# Altium schematic sheet FPGA.schdoc: =ProjectName
size A2; Author: P.K.; CompanyName: WUT; DrawnBy: P.K.; Organization: WUT ISE; Address1: Warsaw Univeristy of Technology; Address2: Nowowiejska 15/19; DocumentNumber: 2; Revision: 1.1; SheetNumber: 2; SheetTotal: 12; EDA_Number: ARTIQ; Projet: ARTIQ/SINARA; ModifiedBy: -; CreateDate: XX/XX/XXXX; CheckedDate: -; Title2: FPGA.schdoc; DivGrp: ISE; Designer: P.K.; ModifiedDate: -; ProjectName: ARTIQ/SINARA
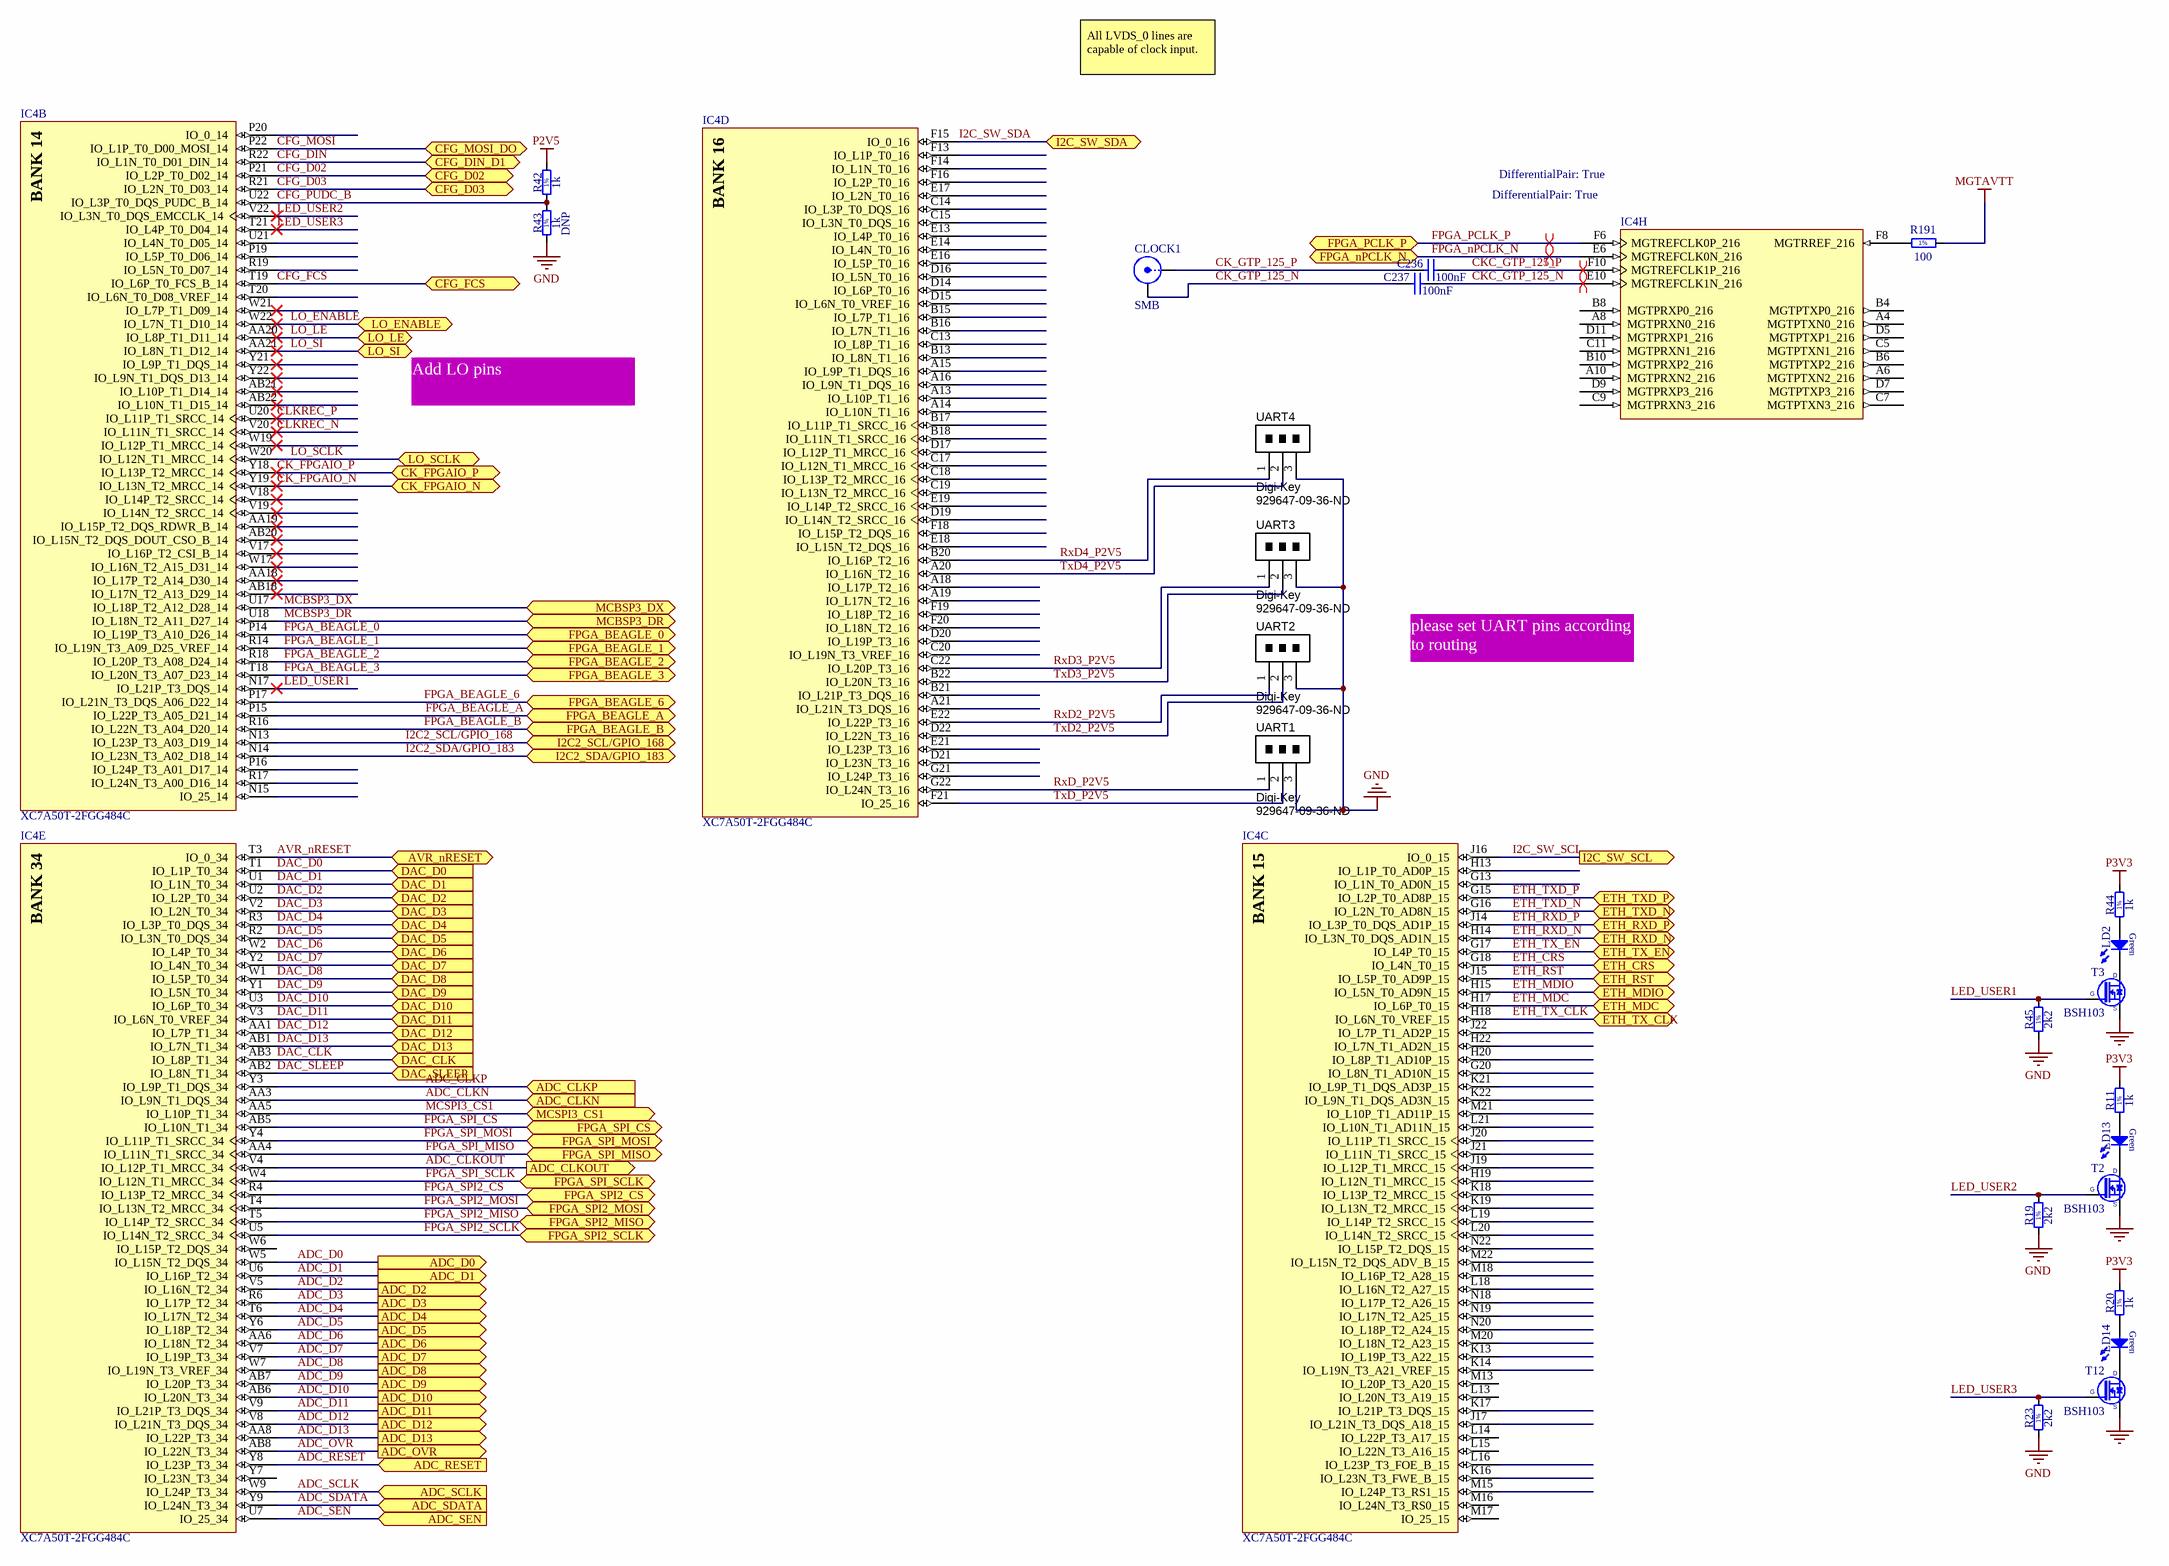
[diagram p0: FPGA.schdoc]

## Parts
(Parts that share a designator on the sheet are numbered #1, #2 ... from top to bottom, then left to right.)
C236  100nF  [0603 Polar Cap]
C237  100nF  [0603 Polar Cap]
CLOCK1  SMB  [SMB_V-RJ45]
IC4#1  XC7A50T-2FGG484C  [FGG484]  (part B of 10)
IC4#2  XC7A50T-2FGG484C  [FGG484]  (parts C,D,E,H of 10)
LD2  (no value)  [LED-0603-GREEN]
LD13  (no value)  [LED-0603-GREEN]
LD14  (no value)  [LED-0603-GREEN]
R11  1k  [RESC1005X40N]
R19  2k2  [RESC1005X40N]
R20  1k  [RESC1005X40N]
R23  2k2  [RESC1005X40N]
R42  1k  [RESC1005X40N]
R43  1k  [RESC1005X40N]
R44  1k  [RESC1005X40N]
R45  2k2  [RESC1005X40N]
R191  100  [RESC1005X40N]
T2  BSH103  [SOT95P230X110-3N]
T3  BSH103  [SOT95P230X110-3N]
T12  BSH103  [SOT95P230X110-3N]
UART1  Supplier 1: Digi-Key  Supplier Part Number 1: 929647-09-36-ND  [1x3POS_HEADER]  (hidden comment: R T G)
UART2  Supplier 1: Digi-Key  Supplier Part Number 1: 929647-09-36-ND  [1x3POS_HEADER]  (hidden comment: R T G)
UART3  Supplier 1: Digi-Key  Supplier Part Number 1: 929647-09-36-ND  [1x3POS_HEADER]  (hidden comment: R T G)
UART4  Supplier 1: Digi-Key  Supplier Part Number 1: 929647-09-36-ND  [1x3POS_HEADER]  (hidden comment: R T G)

## Ports
ADC_CLKN (in), ADC_CLKOUT (out), ADC_CLKP (in), ADC_D0 (out), ADC_D1 (out), ADC_D2 (out), ADC_D3 (out), ADC_D4 (out), ADC_D5 (out), ADC_D6 (out), ADC_D7 (out), ADC_D8 (out), ADC_D9 (out), ADC_D10 (out), ADC_D11 (out), ADC_D12 (out), ADC_D13 (out), ADC_OVR (out), ADC_RESET (in), ADC_SCLK (in), ADC_SDATA (in), ADC_SEN (in), AVR_nRESET (bidir), CFG_D02 (bidir), CFG_D03 (bidir), CFG_DIN_D1 (bidir), CFG_FCS (bidir), CFG_MOSI_DO (bidir), CK_FPGAIO_N (bidir), CK_FPGAIO_P (bidir), DAC_CLK (in), DAC_D0 (in), DAC_D1 (in), DAC_D2 (in), DAC_D3 (in), DAC_D4 (in), DAC_D5 (in), DAC_D6 (in), DAC_D7 (in), DAC_D8 (in), DAC_D9 (in), DAC_D10 (in), DAC_D11 (in), DAC_D12 (in), DAC_D13 (in), DAC_SLEEP (in), ETH_CRS, ETH_MDC, ETH_MDIO, ETH_RST, ETH_RXD_N, ETH_RXD_P, ETH_TX_CLK, ETH_TX_EN, ETH_TXD_N, ETH_TXD_P, FPGA_BEAGLE_0 (bidir), FPGA_BEAGLE_1 (bidir), FPGA_BEAGLE_2 (bidir), FPGA_BEAGLE_3 (bidir), FPGA_BEAGLE_6 (bidir), FPGA_BEAGLE_A (bidir), FPGA_BEAGLE_B (bidir), FPGA_nPCLK_N (bidir), FPGA_PCLK_P (bidir), FPGA_SPI2_CS (bidir), FPGA_SPI2_MISO (bidir), FPGA_SPI2_MOSI (bidir), FPGA_SPI2_SCLK (bidir), FPGA_SPI_CS (bidir), FPGA_SPI_MISO (bidir), FPGA_SPI_MOSI (bidir), FPGA_SPI_SCLK (bidir), I2C2_SCL/GPIO_168 (bidir), I2C2_SDA/GPIO_183 (bidir), I2C_SW_SCL (out), I2C_SW_SDA (bidir), LO_ENABLE, LO_LE, LO_SCLK, LO_SI, MCBSP3_DR (bidir), MCBSP3_DX (bidir), MCSPI3_CS1 (bidir)

## Nets
GND: R19.1 R23.1 R43.1 R45.1 T2.2(S) T3.2(S) T12.2(S) UART1.3 UART2.3 UART3.3 UART4.3
MGTAVTT: R191.1
P2V5: R42.2
P3V3: R11.2 R20.2 R44.2
ADC_CLKN: IC4#2.AA3(IO_L9N_T1_DQS_34) ; port ADC_CLKN
ADC_CLKOUT: IC4#2.V4(IO_L12P_T1_MRCC_34) ; port ADC_CLKOUT
ADC_CLKP: IC4#2.Y3(IO_L9P_T1_DQS_34) ; port ADC_CLKP
ADC_D0: IC4#2.W5(IO_L15N_T2_DQS_34) ; port ADC_D0
ADC_D1: IC4#2.U6(IO_L16P_T2_34) ; port ADC_D1
ADC_D2: IC4#2.V5(IO_L16N_T2_34) ; port ADC_D2
ADC_D3: IC4#2.R6(IO_L17P_T2_34) ; port ADC_D3
ADC_D4: IC4#2.T6(IO_L17N_T2_34) ; port ADC_D4
ADC_D5: IC4#2.Y6(IO_L18P_T2_34) ; port ADC_D5
ADC_D6: IC4#2.AA6(IO_L18N_T2_34) ; port ADC_D6
ADC_D7: IC4#2.V7(IO_L19P_T3_34) ; port ADC_D7
ADC_D8: IC4#2.W7(IO_L19N_T3_VREF_34) ; port ADC_D8
ADC_D9: IC4#2.AB7(IO_L20P_T3_34) ; port ADC_D9
ADC_D10: IC4#2.AB6(IO_L20N_T3_34) ; port ADC_D10
ADC_D11: IC4#2.V9(IO_L21P_T3_DQS_34) ; port ADC_D11
ADC_D12: IC4#2.V8(IO_L21N_T3_DQS_34) ; port ADC_D12
ADC_D13: IC4#2.AA8(IO_L22P_T3_34) ; port ADC_D13
ADC_OVR: IC4#2.AB8(IO_L22N_T3_34) ; port ADC_OVR
ADC_RESET: IC4#2.Y8(IO_L23P_T3_34) ; port ADC_RESET
ADC_SCLK: IC4#2.W9(IO_L24P_T3_34) ; port ADC_SCLK
ADC_SDATA: IC4#2.Y9(IO_L24N_T3_34) ; port ADC_SDATA
ADC_SEN: IC4#2.U7(IO_25_34) ; port ADC_SEN
AVR_nRESET: IC4#2.T3(IO_0_34) ; port AVR_nRESET
CFG_D02: IC4#1.P21(IO_L2P_T0_D02_14) ; port CFG_D02
CFG_D03: IC4#1.R21(IO_L2N_T0_D03_14) ; port CFG_D03
CFG_DIN: IC4#1.R22(IO_L1N_T0_D01_DIN_14) ; port CFG_DIN_D1
CFG_FCS: IC4#1.T19(IO_L6P_T0_FCS_B_14) ; port CFG_FCS
CFG_MOSI: IC4#1.P22(IO_L1P_T0_D00_MOSI_14) ; port CFG_MOSI_DO
CFG_PUDC_B: IC4#1.U22(IO_L3P_T0_DQS_PUDC_B_14) R42.1 R43.2
CK_FPGAIO_N: IC4#1.Y19(IO_L13N_T2_MRCC_14) ; port CK_FPGAIO_N
CK_FPGAIO_P: IC4#1.Y18(IO_L13P_T2_MRCC_14) ; port CK_FPGAIO_P
CK_GTP_125_N: C237.1 CLOCK1.2(Y)
CK_GTP_125_P: C236.1 CLOCK1.1(X)
CKC_GTP_125_N: C237.2 IC4#2.E10(MGTREFCLK1N_216)
CKC_GTP_125_P: C236.2 IC4#2.F10(MGTREFCLK1P_216)
CLKREC_N: IC4#1.V20(IO_L11N_T1_SRCC_14)
CLKREC_P: IC4#1.U20(IO_L11P_T1_SRCC_14)
DAC_CLK: IC4#2.AB3(IO_L8P_T1_34) ; port DAC_CLK
DAC_D0: IC4#2.T1(IO_L1P_T0_34) ; port DAC_D0
DAC_D1: IC4#2.U1(IO_L1N_T0_34) ; port DAC_D1
DAC_D2: IC4#2.U2(IO_L2P_T0_34) ; port DAC_D2
DAC_D3: IC4#2.V2(IO_L2N_T0_34) ; port DAC_D3
DAC_D4: IC4#2.R3(IO_L3P_T0_DQS_34) ; port DAC_D4
DAC_D5: IC4#2.R2(IO_L3N_T0_DQS_34) ; port DAC_D5
DAC_D6: IC4#2.W2(IO_L4P_T0_34) ; port DAC_D6
DAC_D7: IC4#2.Y2(IO_L4N_T0_34) ; port DAC_D7
DAC_D8: IC4#2.W1(IO_L5P_T0_34) ; port DAC_D8
DAC_D9: IC4#2.Y1(IO_L5N_T0_34) ; port DAC_D9
DAC_D10: IC4#2.U3(IO_L6P_T0_34) ; port DAC_D10
DAC_D11: IC4#2.V3(IO_L6N_T0_VREF_34) ; port DAC_D11
DAC_D12: IC4#2.AA1(IO_L7P_T1_34) ; port DAC_D12
DAC_D13: IC4#2.AB1(IO_L7N_T1_34) ; port DAC_D13
DAC_SLEEP: IC4#2.AB2(IO_L8N_T1_34) ; port DAC_SLEEP
ETH_CRS: IC4#2.G18(IO_L4N_T0_15) ; port ETH_CRS
ETH_MDC: IC4#2.H17(IO_L6P_T0_15) ; port ETH_MDC
ETH_MDIO: IC4#2.H15(IO_L5N_T0_AD9N_15) ; port ETH_MDIO
ETH_RST: IC4#2.J15(IO_L5P_T0_AD9P_15) ; port ETH_RST
ETH_RXD_N: IC4#2.H14(IO_L3N_T0_DQS_AD1N_15) ; port ETH_RXD_N
ETH_RXD_P: IC4#2.J14(IO_L3P_T0_DQS_AD1P_15) ; port ETH_RXD_P
ETH_TX_CLK: IC4#2.H18(IO_L6N_T0_VREF_15) ; port ETH_TX_CLK
ETH_TX_EN: IC4#2.G17(IO_L4P_T0_15) ; port ETH_TX_EN
ETH_TXD_N: IC4#2.G16(IO_L2N_T0_AD8N_15) ; port ETH_TXD_N
ETH_TXD_P: IC4#2.G15(IO_L2P_T0_AD8P_15) ; port ETH_TXD_P
FPGA_BEAGLE_0: IC4#1.P14(IO_L19P_T3_A10_D26_14) ; port FPGA_BEAGLE_0
FPGA_BEAGLE_1: IC4#1.R14(IO_L19N_T3_A09_D25_VREF_14) ; port FPGA_BEAGLE_1
FPGA_BEAGLE_2: IC4#1.R18(IO_L20P_T3_A08_D24_14) ; port FPGA_BEAGLE_2
FPGA_BEAGLE_3: IC4#1.T18(IO_L20N_T3_A07_D23_14) ; port FPGA_BEAGLE_3
FPGA_BEAGLE_6: IC4#1.P17(IO_L21N_T3_DQS_A06_D22_14) ; port FPGA_BEAGLE_6
FPGA_BEAGLE_A: IC4#1.P15(IO_L22P_T3_A05_D21_14) ; port FPGA_BEAGLE_A
FPGA_BEAGLE_B: IC4#1.R16(IO_L22N_T3_A04_D20_14) ; port FPGA_BEAGLE_B
FPGA_nPCLK_N: IC4#2.E6(MGTREFCLK0N_216) ; port FPGA_nPCLK_N
FPGA_PCLK_P: IC4#2.F6(MGTREFCLK0P_216) ; port FPGA_PCLK_P
FPGA_SPI2_CS: IC4#2.R4(IO_L13P_T2_MRCC_34) ; port FPGA_SPI2_CS
FPGA_SPI2_MISO: IC4#2.T5(IO_L14P_T2_SRCC_34) ; port FPGA_SPI2_MISO
FPGA_SPI2_MOSI: IC4#2.T4(IO_L13N_T2_MRCC_34) ; port FPGA_SPI2_MOSI
FPGA_SPI2_SCLK: IC4#2.U5(IO_L14N_T2_SRCC_34) ; port FPGA_SPI2_SCLK
FPGA_SPI_CS: IC4#2.AB5(IO_L10N_T1_34) ; port FPGA_SPI_CS
FPGA_SPI_MISO: IC4#2.AA4(IO_L11N_T1_SRCC_34) ; port FPGA_SPI_MISO
FPGA_SPI_MOSI: IC4#2.Y4(IO_L11P_T1_SRCC_34) ; port FPGA_SPI_MOSI
FPGA_SPI_SCLK: IC4#2.W4(IO_L12N_T1_MRCC_34) ; port FPGA_SPI_SCLK
I2C2_SCL/GPIO_168: IC4#1.N13(IO_L23P_T3_A03_D19_14) ; port I2C2_SCL/GPIO_168
I2C2_SDA/GPIO_183: IC4#1.N14(IO_L23N_T3_A02_D18_14) ; port I2C2_SDA/GPIO_183
I2C_SW_SCL: IC4#2.J16(IO_0_15) ; port I2C_SW_SCL
I2C_SW_SDA: IC4#2.F15(IO_0_16) ; port I2C_SW_SDA
LED_USER1: IC4#1.N17(IO_L21P_T3_DQS_14) R45.2 T3.1(G)
LED_USER2: IC4#1.V22(IO_L3N_T0_DQS_EMCCLK_14) R19.2 T2.1(G)
LED_USER3: IC4#1.T21(IO_L4P_T0_D04_14) R23.2 T12.1(G)
LO_ENABLE: IC4#1.W22(IO_L7N_T1_D10_14) ; port LO_ENABLE
LO_LE: IC4#1.AA20(IO_L8P_T1_D11_14) ; port LO_LE
LO_SCLK: IC4#1.W20(IO_L12N_T1_MRCC_14) ; port LO_SCLK
LO_SI: IC4#1.AA21(IO_L8N_T1_D12_14) ; port LO_SI
MCBSP3_DR: IC4#1.U18(IO_L18N_T2_A11_D27_14)
MCBSP3_DX: IC4#1.U17(IO_L18P_T2_A12_D28_14) ; port MCBSP3_DX
MCSPI3_CS1: IC4#2.AA5(IO_L10P_T1_34) ; port MCSPI3_CS1
RxD2_P2V5: IC4#2.E22(IO_L22P_T3_16) UART2.1
RxD3_P2V5: IC4#2.C22(IO_L20P_T3_16) UART3.1
RxD4_P2V5: IC4#2.B20(IO_L16P_T2_16) UART4.1
RxD_P2V5: IC4#2.G22(IO_L24N_T3_16) UART1.1
TxD2_P2V5: IC4#2.D22(IO_L22N_T3_16) UART2.2
TxD3_P2V5: IC4#2.B22(IO_L20N_T3_16) UART3.2
TxD4_P2V5: IC4#2.A20(IO_L16N_T2_16) UART4.2
TxD_P2V5: IC4#2.F21(IO_25_16) UART1.2
NetIC4#2_F8: IC4#2.F8(MGTRREF_216) R191.2
NetLD2_1: LD2.1(A) R44.1
NetLD2_2: LD2.2(C) T3.3(D)
NetLD13_1: LD13.1(A) R11.1
NetLD13_2: LD13.2(C) T2.3(D)
NetLD14_1: LD14.1(A) R20.1
NetLD14_2: LD14.2(C) T12.3(D)

Not connected (* = marked no-connect by the designer): IC4#1 AA18(IO_L17P_T2_A14_D30_14)* AA19(IO_L15P_T2_DQS_RDWR_B_14)* AB18(IO_L17N_T2_A13_D29_14)* AB20(IO_L15N_T2_DQS_DOUT_CSO_B_14)* AB21(IO_L10P_T1_D14_14)* AB22(IO_L10N_T1_D15_14)* N15(IO_25_14) P16(IO_L24P_T3_A01_D17_14) P19(IO_L5P_T0_D06_14) P20(IO_0_14) R17(IO_L24N_T3_A00_D16_14) R19(IO_L5N_T0_D07_14) T20(IO_L6N_T0_D08_VREF_14) U21(IO_L4N_T0_D05_14) V17(IO_L16P_T2_CSI_B_14)* V18(IO_L14P_T2_SRCC_14)* V19(IO_L14N_T2_SRCC_14)* W17(IO_L16N_T2_A15_D31_14)* W19(IO_L12P_T1_MRCC_14)* W21(IO_L7P_T1_D09_14)* Y21(IO_L9P_T1_DQS_14)* Y22(IO_L9N_T1_DQS_D13_14)*; IC4#2 A4(MGTPTXN0_216) A6(MGTPTXN2_216) A8(MGTPRXN0_216) A10(MGTPRXN2_216) A13(IO_L10P_T1_16) A14(IO_L10N_T1_16) A15(IO_L9P_T1_DQS_16) A16(IO_L9N_T1_DQS_16) A18(IO_L17P_T2_16) A19(IO_L17N_T2_16) A21(IO_L21N_T3_DQS_16) B4(MGTPTXP0_216) B6(MGTPTXP2_216) B8(MGTPRXP0_216) B10(MGTPRXP2_216) B13(IO_L8N_T1_16) B15(IO_L7P_T1_16) B16(IO_L7N_T1_16) B17(IO_L11P_T1_SRCC_16) B18(IO_L11N_T1_SRCC_16) B21(IO_L21P_T3_DQS_16) C5(MGTPTXN1_216) C7(MGTPTXN3_216) C9(MGTPRXN3_216) C11(MGTPRXN1_216) C13(IO_L8P_T1_16) C14(IO_L3P_T0_DQS_16) C15(IO_L3N_T0_DQS_16) C17(IO_L12N_T1_MRCC_16) C18(IO_L13P_T2_MRCC_16) C19(IO_L13N_T2_MRCC_16) C20(IO_L19N_T3_VREF_16) D5(MGTPTXP1_216) D7(MGTPTXP3_216) D9(MGTPRXP3_216) D11(MGTPRXP1_216) D14(IO_L6P_T0_16) D15(IO_L6N_T0_VREF_16) D16(IO_L5N_T0_16) D17(IO_L12P_T1_MRCC_16) D19(IO_L14N_T2_SRCC_16) D20(IO_L19P_T3_16) D21(IO_L23N_T3_16) E13(IO_L4P_T0_16) E14(IO_L4N_T0_16) E16(IO_L5P_T0_16) E17(IO_L2N_T0_16) E18(IO_L15N_T2_DQS_16) E19(IO_L14P_T2_SRCC_16) E21(IO_L23P_T3_16) F13(IO_L1P_T0_16) F14(IO_L1N_T0_16) F16(IO_L2P_T0_16) F18(IO_L15P_T2_DQS_16) F19(IO_L18P_T2_16) F20(IO_L18N_T2_16) G13(IO_L1N_T0_AD0N_15) G20(IO_L8N_T1_AD10N_15) G21(IO_L24P_T3_16) H13(IO_L1P_T0_AD0P_15) H19(IO_L12N_T1_MRCC_15) H20(IO_L8P_T1_AD10P_15) H22(IO_L7N_T1_AD2N_15) J17(IO_L21N_T3_DQS_A18_15) J19(IO_L12P_T1_MRCC_15) J20(IO_L11P_T1_SRCC_15) J21(IO_L11N_T1_SRCC_15) J22(IO_L7P_T1_AD2P_15) K13(IO_L19P_T3_A22_15) K14(IO_L19N_T3_A21_VREF_15) K16(IO_L23N_T3_FWE_B_15) K17(IO_L21P_T3_DQS_15) K18(IO_L13P_T2_MRCC_15) K19(IO_L13N_T2_MRCC_15) K21(IO_L9P_T1_DQS_AD3P_15) K22(IO_L9N_T1_DQS_AD3N_15) L13(IO_L20N_T3_A19_15) L14(IO_L22P_T3_A17_15) L15(IO_L22N_T3_A16_15) L16(IO_L23P_T3_FOE_B_15) L18(IO_L16N_T2_A27_15) L19(IO_L14P_T2_SRCC_15) L20(IO_L14N_T2_SRCC_15) L21(IO_L10N_T1_AD11N_15) M13(IO_L20P_T3_A20_15) M15(IO_L24P_T3_RS1_15) M16(IO_L24N_T3_RS0_15) M17(IO_25_15) M18(IO_L16P_T2_A28_15) M20(IO_L18N_T2_A23_15) M21(IO_L10P_T1_AD11P_15) M22(IO_L15N_T2_DQS_ADV_B_15) N18(IO_L17P_T2_A26_15) N19(IO_L17N_T2_A25_15) N20(IO_L18P_T2_A24_15) N22(IO_L15P_T2_DQS_15) W6(IO_L15P_T2_DQS_34) Y7(IO_L23N_T3_34)

## Layout directives
differential pair: FPGA_nPCLK_N, FPGA_PCLK_P
differential pair; net class Diff_100Ohm: CKC_GTP_125_N, CKC_GTP_125_P

## Notes on the sheet
- All LVDS_0 lines are capable of clock input.
- (near R43) DNP
- Add LO pins
- please set UART pins according to routing
- (in symbol CMP-0364-00026-3, part B) BANK 14
- (in symbol CMP-0364-00026-3, part C) BANK 15
- (in symbol CMP-0364-00026-3, part D) BANK 16
- (in symbol CMP-0364-00026-3, part E) BANK 34
- (in symbol KINGBRIGHT_KPTR-3216CGCK) Green
- (in symbol R0402_1k_1%_0.0625W_100PPM) 1%
- (in symbol R0402_1K_1%_0.0625W_100PPM) 1%
- (in symbol R0402_2K2_1%_0.0625W_100PPM) 1%
- (in symbol R0402_100R_1%_0.0625W_100PPM) 1%

## Library data of the parts
C236 C237 = CC0201_100NF_6.3V_10%_X5R: Non-polarised capacitor; Part Description: SMD Multilayer Chip Ceramic Capacitor; Manufacturer: GENERIC; Manufacturer1 Part Number: 02016D104KAT2A; Voltage: 6.3V; TC: X5R; Tolerance: ±10%; Part Number: CC0201_100NF_6.3V_10%_X5R; Component Kind: Standard; Component Type: Standard; Footprint: CAPC0603X33N; Pin Count: 2; Value: 100nF; Status: Not Recommended; Manufacturer Part Number: CC0201_100NF_6.3V_10%_X5R; Case: 0201; Mounted: Yes; Socket: No; SMD: Yes; Sense: No; Manufacturer1 Example: AVX; Manufacturer1 ComponentHeight: 0.33mm; HelpURL: \\cern.ch\dfs\Applications\Altium\Datasheets\CC0201_X5R_AVX.pdf; Author: CERN DEM JLC; CreateDate: 2007-12-03; LatestRevisionDate: 2007-12-03
CLOCK1 = SMB: SMB Straight Connector; LatestRevisionDate: 17-Jul-2002; LatestRevisionNote: Re-released for DXP Platform.; Publisher: Altium Limited
IC4#1 = CMP-0364-00026-3: Artix-7 FPGA, 285 User I/Os, 4 GTP, 484-Ball BGA, Speed Grade 2, Commercial Grade, Pb-Free; Manufacturer: Xilinx; Max User I/O: 300; Clock Mgmt Tiles (CMTs): 6; Block RAM Blocks (36Kb): 135; Block RAM Blocks (18Kb): 270; Speed Grade: -2; CLBs (Slices): 15850; Block RAM Blocks (Max Kb): 4860; DSP48E1 Slices: 240; RoHS: Pb-Free; ComponentLink3URL: http://www.xilinx.com/support/documentation/data_sheets/ds181_Artix_7_Data_Sheet.pdf; NexusDeviceID: XC7A50T-2FGG484C; DatasheetVersion: v1.12; Mounting Technology: Surface Mount; PackageDescription: Wire-Bond Fine-Pitch BGA, Body 23 x 23 mm, 1.0 mm Pitch; PackageReference: FGG484; ComponentLink2Description: Package Specification; Code_JEDEC: MS-034-AAJ-1; ComponentLink2URL: http://www.xilinx.com/support/documentation/user_guides/ug475_7Series_Pkg_Pinout.pdf; ComponentLink3Description: DC and Switching Characteristics; Generic Part Number: XC7A50T; ComponentLink4Description: Package File; ComponentLink4URL: http://www.xilinx.com/support/packagefiles/a7packages/xc7a100tfgg484pkg.txt; ComponentLink1URL: http://www.xilinx.com/support/documentation/data_sheets/ds180_7Series_Overview.pdf; PartNumber: XC7A50T-2FGG484C; ComponentLink5URL: http://www.xilinx.com/support/documentation/user_guides/ug475_7Series_Pkg_Pinout.pdf; PackageVersion: Rev 1.8; ComponentLink5Description: Packaging and Pinout; ComponentLink1Description: Datasheet; CLBs (Max Distributed RAM Kb): 1188; ClassName: Artix
IC4#2 = CMP-0364-00026-3: Artix-7 FPGA, 285 User I/Os, 4 GTP, 484-Ball BGA, Speed Grade 2, Commercial Grade, Pb-Free; Generic Part Number: XC7A100T; Manufacturer: Xilinx; Max User I/O: 300; Clock Mgmt Tiles (CMTs): 6; Logic Cells: 101440; Block RAM Blocks (36Kb): 135; Block RAM Blocks (18Kb): 270; Speed Grade: -2; CLBs (Slices): 15850; Block RAM Blocks (Max Kb): 4860; DSP48E1 Slices: 240; RoHS: Pb-Free; ComponentLink3URL: http://www.xilinx.com/support/documentation/data_sheets/ds181_Artix_7_Data_Sheet.pdf; NexusDeviceID: XC7A100T-2FGG484C; DatasheetVersion: v1.12; Mounting Technology: Surface Mount; PackageDescription: Wire-Bond Fine-Pitch BGA, Body 23 x 23 mm, 1.0 mm Pitch; PackageReference: FGG484; ComponentLink2Description: Package Specification; Code_JEDEC: MS-034-AAJ-1; ComponentLink2URL: http://www.xilinx.com/support/documentation/user_guides/ug475_7Series_Pkg_Pinout.pdf; ComponentLink3Description: DC and Switching Characteristics; ComponentLink4Description: Package File; ComponentLink4URL: http://www.xilinx.com/support/packagefiles/a7packages/xc7a100tfgg484pkg.txt; ComponentLink1URL: http://www.xilinx.com/support/documentation/data_sheets/ds180_7Series_Overview.pdf; PartNumber: XC7A100T-2FGG484C; ComponentLink5URL: http://www.xilinx.com/support/documentation/user_guides/ug475_7Series_Pkg_Pinout.pdf; PackageVersion: Rev 1.8; ComponentLink5Description: Packaging and Pinout; ComponentLink1Description: Datasheet; CLBs (Max Distributed RAM Kb): 1188; ClassName: Artix
LD2 LD13 LD14 = KINGBRIGHT_KPTR-3216CGCK: LED Green 1A 2C; Manufacturer Part Number: KPH-1608CGCK; ComponentHeight: 0.65mm; HelpURL: http://datasheet.octopart.com/KPH-1608CGCK-Kingbright-datasheet-62316526.pdf; Package Description: SMT Green LED, Case 0603, Body L 1.6 x W 0.8mm H 0.65mm
R11 R20 R44 = R0402_1k_1%_0.0625W_100PPM: Resistor - 1%; Part Description: General Purpose Thick Film Chip Resistor; Manufacturer: GENERIC; Manufacturer1 Part Number: 232270671002L; TC: ±100ppm/°C; PressFit: No; Part Number: R0402_1K_1%_0.0625W_100PPM; Component Kind: Standard; Component Type: Standard; Pin Count: 2; Value: 1k; Status: Not Recommended; Power: 0.0625W; Tolerance: ±1%; Manufacturer Part Number: R0402_1K_1%_0.0625W_100PPM; Case: 0402; Mounted: Yes; Sense: No; Socket: No; SMD: Yes; Manufacturer1 Example: YAGEO PHYCOMP; Manufacturer1 ComponentHeight: 0.4mm; HelpURL: \\cern.ch\dfs\Applications\Altium\Datasheets\R0402_Phycomp_RC0402.pdf; Author: CERN DEM JLC; CreateDate: 03.12.2007; LatestRevisionDate: 17.10.2012; ClassName: Artix
R19 R23 R45 = R0402_2K2_1%_0.0625W_100PPM: Resistor - 1%; Part Description: General Purpose Thick Film Chip Resistor; Manufacturer: GENERIC; Manufacturer1 Part Number: 232270672202L; TC: ±100ppm/°C; PressFit: No; Part Number: R0402_2K2_1%_0.0625W_100PPM; Component Kind: Standard; Component Type: Standard; Pin Count: 2; Value: 2k2; Status: Not Recommended; Power: 0.0625W; Tolerance: ±1%; Manufacturer Part Number: R0402_2K2_1%_0.0625W_100PPM; Case: 0402; Mounted: Yes; Sense: No; Socket: No; SMD: Yes; Manufacturer1 Example: YAGEO PHYCOMP; Manufacturer1 ComponentHeight: 0.4mm; HelpURL: \\cern.ch\dfs\Applications\Altium\Datasheets\R0402_Phycomp_RC0402.pdf; Author: CERN DEM JLC; CreateDate: 03.12.2007; LatestRevisionDate: 17.10.2012; ClassName: Artix
R42 R43 = R0402_1K_1%_0.0625W_100PPM: Resistor - 1%; Part Description: General Purpose Thick Film Chip Resistor; Manufacturer: GENERIC; Manufacturer1 Part Number: 232270671002L; TC: ±100ppm/°C; PressFit: No; Part Number: R0402_1K_1%_0.0625W_100PPM; Component Kind: Standard; Component Type: Standard; Pin Count: 2; Value: 1k; Status: Not Recommended; Power: 0.0625W; Tolerance: ±1%; Manufacturer Part Number: R0402_1K_1%_0.0625W_100PPM; Case: 0402; Mounted: Yes; Sense: No; Socket: No; SMD: Yes; Manufacturer1 Example: YAGEO PHYCOMP; Manufacturer1 ComponentHeight: 0.4mm; HelpURL: \\cern.ch\dfs\Applications\Altium\Datasheets\R0402_Phycomp_RC0402.pdf; Author: CERN DEM JLC; CreateDate: 03.12.2007; LatestRevisionDate: 17.10.2012; ClassName: Artix
R191 = R0402_100R_1%_0.0625W_100PPM: Resistor - 1%; Part Description: General Purpose Thick Film Chip Resistor; Manufacturer: GENERIC; Manufacturer1 Part Number: 232270671001L; TC: ±100ppm/°C; PressFit: No; Part Number: R0402_100R_1%_0.0625W_100PPM; Component Kind: Standard; Component Type: Standard; Pin Count: 2; Value: 100; Status: Not Recommended; Power: 0.0625W; Tolerance: ±1%; Manufacturer Part Number: R0402_100R_1%_0.0625W_100PPM; Case: 0402; Mounted: Yes; Sense: No; Socket: No; SMD: Yes; Manufacturer1 Example: YAGEO PHYCOMP; Manufacturer1 ComponentHeight: 0.4mm; HelpURL: \\cern.ch\dfs\Applications\Altium\Datasheets\R0402_Phycomp_RC0402.pdf; Author: CERN DEM JLC; CreateDate: 03.12.2007; LatestRevisionDate: 17.10.2012; ClassName: Artix
T2 T3 T12 = BSH103: N-CHANNEL MOSFET WITH DIODE; Part Description: 30V 850mA N-Channel Enhancement Mode Field-Effect Transistor; Manufacturer: NEXPERIA; PressFit: No; Bonding: No; Part Number: BSH103; Component Kind: Standard; Component Type: Standard; Device: BSH103; PackageDescription: SOT23, 3 pin, Pitch 0.95mm - 1.3mm W X 2.9mm L X 1.1mm H, IPC Medium Density; Manufacturer Part Number: BSH103; Pin Count: 3; Case: SOT23-3; Mounted: Yes; Socket: No; SMD: Yes; Sense: No; ComponentHeight: 1.1mm; HelpURL: \\cern.ch\dfs\Applications\Altium\Datasheets\BSH103.pdf; Author: CERN DEM JLC; CreateDate: 16.03.2010; LatestRevisionDate: 20.06.2017; ClassName: Artix
UART1-UART4 = CONN_HEADER_1x3P_0.100in: Pin Header, THT, Single-row, 2.54mm pitch; Manufacturer 1: 3M; Manufacturer Part Number 1: 929647-09-36-I; Pitch: 0.100" (2.54mm); Value: Single-row, 3 positions; QtyOverride: 0.1; SCDType: undef; Category: Connectors; Mounting Type: Through Hole; Terminal Block Type: Header, Male Pins, Single; Package / Case: Pin header; 2.54mm pitch